# EAGLE design arduino_shield (EAGLE 8.3.1)
Integrated shield for surverying land based on altimeter, GPS, and file logging.
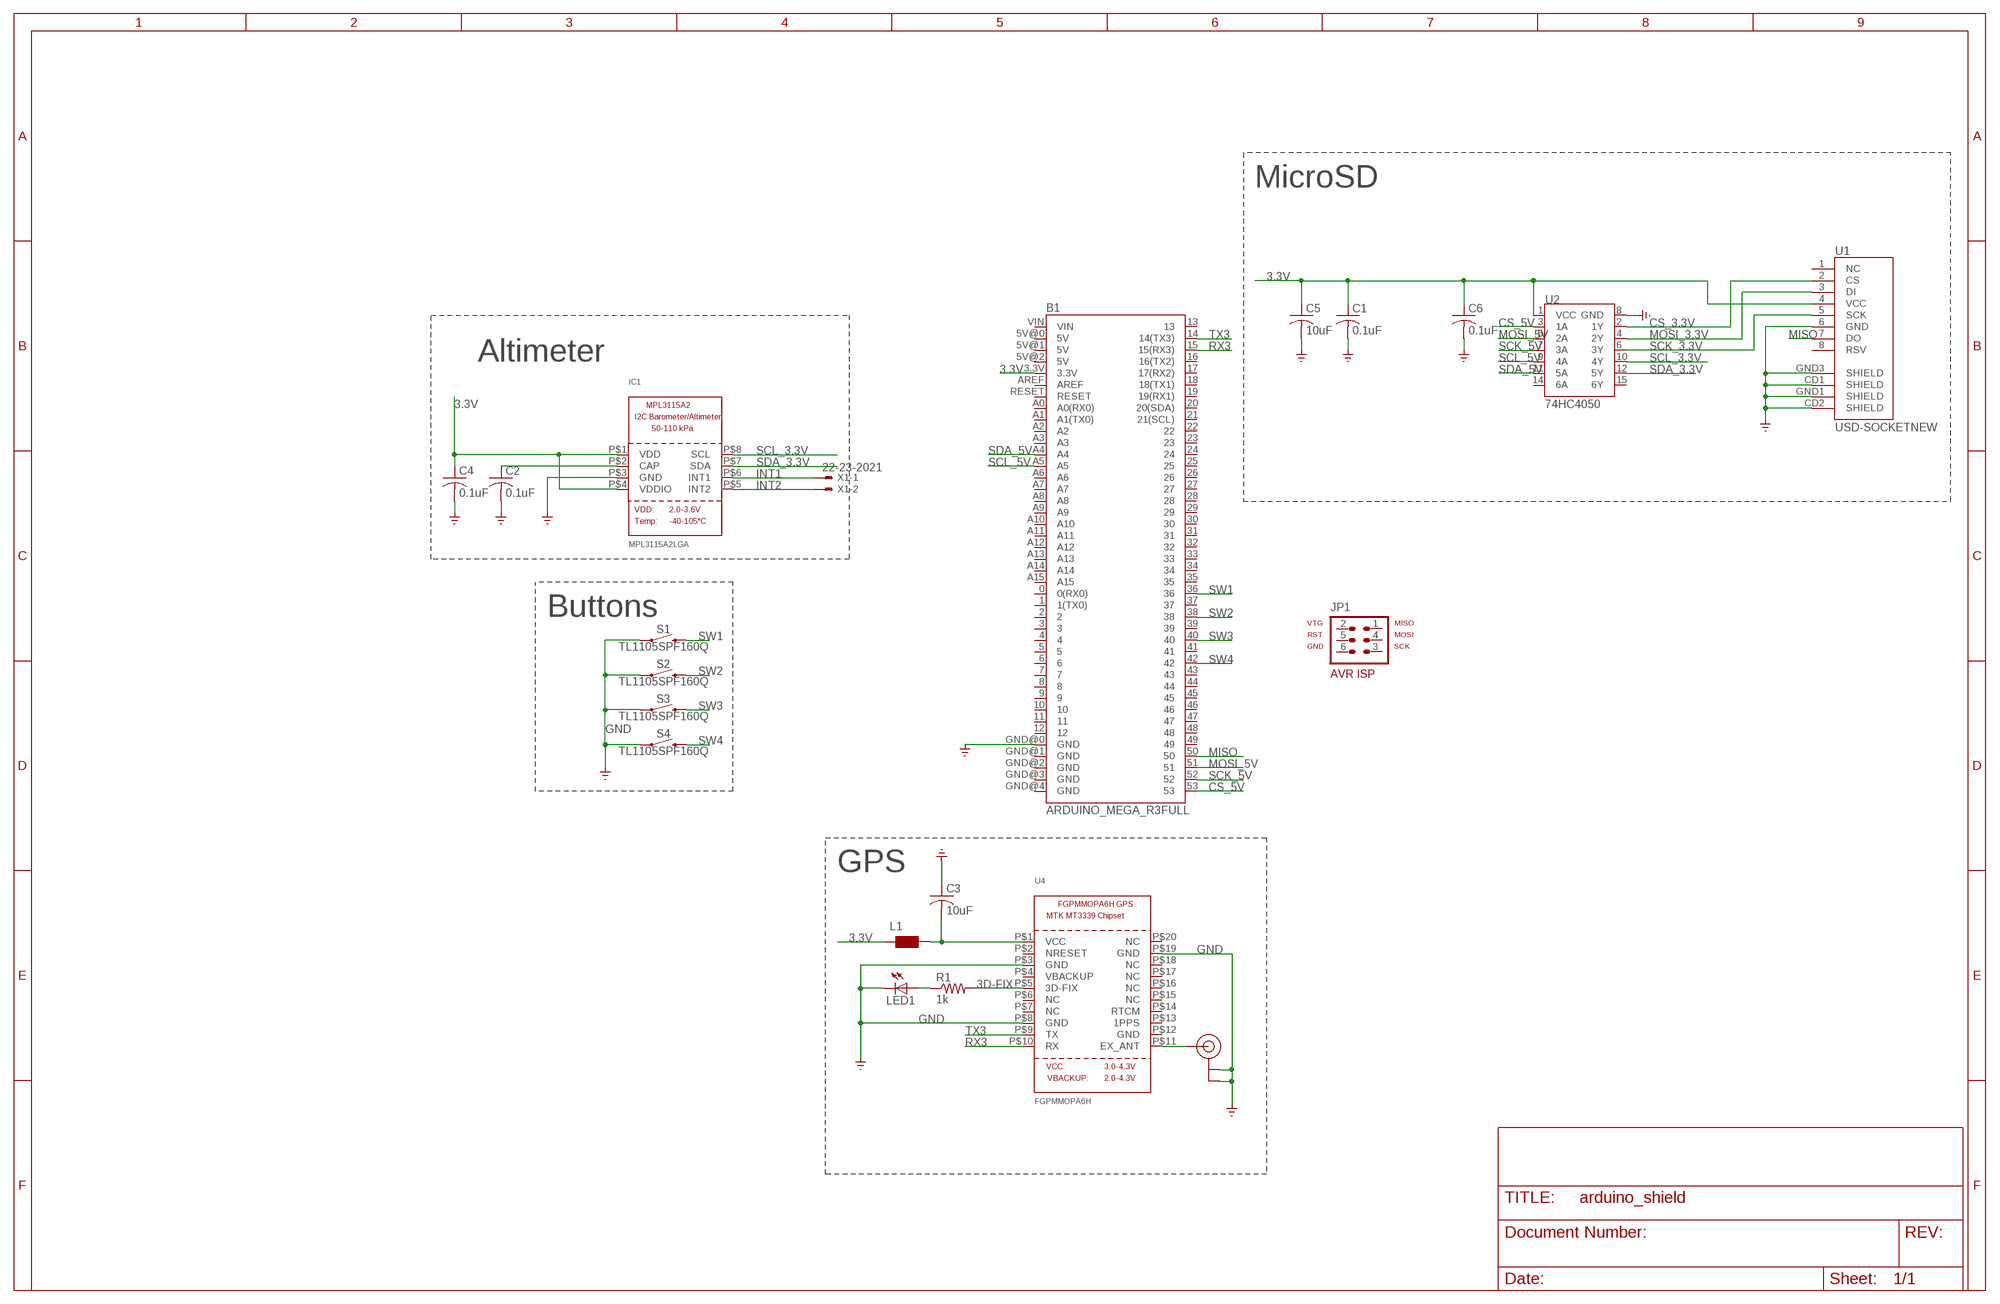
[diagram p0: schematic, sheet 1]

## Parts
B1  ARDUINO_MEGA_R3FULL  [ARDUINO_MEGA]
C1  0.1uF  C-USC1206  [C1206]
C2  0.1uF  C-USC1206  [C1206]
C3  10uF  C-USC1206  [C1206]
C4  0.1uF  C-USC1206  [C1206]
C5  10uF  C-USC1206  [C1206]
C6  0.1uF  C-USC1206  [C1206]
IC1  MPL3115A2LGA  [LGA8]
JP1  AVR-ISP-6  [AVR-ISP-6]
L1  WE-CBF_1206  [1206]
LED1  LEDSMT1206  [1206]
R1  1k  R-US_R1206  [R1206]
S1  TL1105SPF160Q  MOMENTARY-SWITCH-SPST-PTH-6.0MM  [TACTILE_SWITCH_PTH_6.0MM]
S2  TL1105SPF160Q  MOMENTARY-SWITCH-SPST-PTH-6.0MM  [TACTILE_SWITCH_PTH_6.0MM]
S3  TL1105SPF160Q  MOMENTARY-SWITCH-SPST-PTH-6.0MM  [TACTILE_SWITCH_PTH_6.0MM]
S4  TL1105SPF160Q  MOMENTARY-SWITCH-SPST-PTH-6.0MM  [TACTILE_SWITCH_PTH_6.0MM]
U1  USD-SOCKETNEW  [MICRO-SD-SOCKET-PP]
U2  74HC4050  HEX_CONVERTER  [SO16]
U4  FGPMMOPA6H  GPS_FGPMMOPA6H  [FGPMMOPA6H]
U$20  U.FL  [U.FL]
X1  22-23-2021  [22-23-2021]

## Nets
3.3V: B1.3.3V C1.1 C4.1 C5.1 C6.1 IC1.P$1(VDD) IC1.P$4(VDDIO) L1.1 U1.4(VCC) U2.1(VCC)
3D-FIX: R1.2 U4.P$5(3D-FIX)
3D-FIX_R: LED1.A R1.1
3V3_CLEAN: C3.2 L1.2 U4.P$1(VCC)
CAP: C2.1 IC1.P$2(CAP)
CS_3.3V: U1.2(CS) U2.2(1Y)
CS_5V: B1.53 U2.3(1A)
EX_ANT: U4.P$11(EX_ANT) U$20.P$3(SIGNAL)
GND: B1.GND@0(GND) C1.2 C2.2 C3.1 C4.2 C5.2 C6.2 IC1.P$3(GND) LED1.C S1.1 S2.1 S3.1 S4.1 U1.6(GND) U1.CD1(SHIELD) U1.CD2(SHIELD) U1.GND1(SHIELD) U1.GND3(SHIELD) U2.8(GND) U4.P$3(GND) U4.P$8(GND) U4.P$19(GND) U$20.P$1(GND) U$20.P$2(GND) ; supply symbol labelled GND_
INT1: IC1.P$6(INT1) X1.1
INT2: IC1.P$5(INT2) X1.2
MISO: B1.50 U1.7(DO)
MOSI_3.3V: U1.3(DI) U2.4(2Y)
MOSI_5V: B1.51 U2.5(2A)
RX3: B1.15(15(RX3)) U4.P$10(RX)
SCK_3.3V: U1.5(SCK) U2.6(3Y)
SCK_5V: B1.52 U2.7(3A)
SCL_3.3V: IC1.P$8(SCL) U2.10(4Y)
SCL_5V: B1.A5 U2.9(4A)
SDA_3.3V: IC1.P$7(SDA) U2.12(5Y)
SDA_5V: B1.A4 U2.11(5A)
SW1: B1.36 S1.3
SW2: B1.38 S2.3
SW3: B1.40 S3.3
SW4: B1.42 S4.3
TX3: B1.14(14(TX3)) U4.P$9(TX)
Unconnected: B1.0(0(RX0)) B1.1(1(TX0)) B1.2 B1.3 B1.4 B1.5 B1.5V@0(5V) B1.5V@1(5V) B1.5V@2(5V) B1.6 B1.7 B1.8 B1.9 B1.10 B1.11 B1.12 B1.13 B1.16(16(TX2)) B1.17(17(RX2)) B1.18(18(TX1)) B1.19(19(RX1)) B1.20(20(SDA)) B1.21(21(SCL)) B1.22 B1.23 B1.24 B1.25 B1.26 B1.27 B1.28 B1.29 B1.30 B1.31 B1.32 B1.33 B1.34 B1.35 B1.37 B1.39 B1.41 B1.43 B1.44 B1.45 B1.46 B1.47 B1.48 B1.49 B1.A0(A0(RX0)) B1.A1(A1(TX0)) B1.A2 B1.A3 B1.A6 B1.A7 B1.A8 B1.A9 B1.A10 B1.A11 B1.A12 B1.A13 B1.A14 B1.A15 B1.AREF B1.GND@1(GND) B1.GND@2(GND) B1.GND@3(GND) B1.GND@4(GND) B1.RESET B1.VIN JP1.1 JP1.2 JP1.3 JP1.4 JP1.5 JP1.6 U1.1(NC) U1.8(RSV) U2.14(6A) U2.15(6Y) U4.P$2(NRESET) U4.P$4(VBACKUP) U4.P$6(NC) U4.P$7(NC) U4.P$12(GND) U4.P$13(1PPS) U4.P$14(RTCM) U4.P$15(NC) U4.P$16(NC) U4.P$17(NC) U4.P$18(NC) U4.P$20(NC)

## Notes on the sheet
- MicroSD
- Altimeter
- Buttons
- GPS

## Library data of the parts
B1 = SparkFun-Boards:ARDUINO_MEGA_R3: Arduino Mega R3 ATmega2560 R3 compatible footprint. SparkFun Products: Arduino Mega 2560 R3 <https://www.sparkfun.com/products/11061>
C1-C6 = adafruit:C-US: CAPACITOR, American symbol
IC1 = microbuilder:MPL3115A2
JP1 = atmel-1:AVR-ISP-6: AVR ISP-6 Serial Programming Header
L1 = wuerth-elektronik:WE-CBF: SMD EMI Suppression Ferrite Beads - excellent anti-EMI properties - low DCR - impedances till 3000 ohms - rated current up to 6 A
LED1 = adafruit:LED: LED OSRAM: - CHIPLED LG R971, LG N971, LY N971, LG Q971, LY Q971, LO R971, LY R971 LH N974, LH R974 LS Q976, LO Q976, LY Q976 LO Q996 - Hyper CHIPLED LW Q18S LB Q993, LB Q99A, LB R99A - SideLED LS A670, LO A670, LY A670, LG A670, LP A670 LB A673, LV A673, LT A673, LW A673 LH A674 LY A675 LS A676, LA A676, LO A676, LY A676, LW A676 LS A679, LY A679, LG A679 - Hyper Micro SIDELED® LS Y876, LA Y876, LO Y876, LY Y876 LT Y87S - SmartLED LW L88C, LW L88S LB L89C, LB L89S, LG L890 LS L89K, LO L89K, LY L89K LS L896, LA L896, LO L896, LY L896 - TOPLED LS T670, LO T670, LY T670, LG T670, LP T670 LSG T670, LSP T670, LSY T670, LOP T670, LYG T670 LG T671, LOG T671, LSG T671 LB T673, LV T673, LT T673, LW T673 LH T674 LS T676, LA T676, LO T676, LY T676, LB T676, LH T676, LSB T676, LW T676 LB T67C, LV T67C, LT T67C, LS T67K, LO T67K, LY T67K, LW E67C LS E67B, LA E67B, LO E67B, LY E67B, LB E67C, LV E67C, LT E67C LW T67C LS T679, LY T679, LG T679 LS T770, LO T770, LY T770, LG T770, LP T770 LB T773, LV T773, LT T773, LW T773 LH T774 LS E675, LA E675, LY E675, LS T675 LS T776, LA T776, LO T776, LY T776, LB T776 LHGB T686 LT T68C, LB T68C - Hyper Mini TOPLED® LB M676 - Mini TOPLED Santana® LG M470 LS M47K, LO M47K, LY M47K Source: http://www.osram.convergy.de/
R1 = adafruit:R-US_: RESISTOR, American symbol
S1-S4 = SparkFun-Switches:MOMENTARY-SWITCH-SPST: Momentary Switch (Pushbutton) - SPST Normally-open (NO) SPST momentary switches (buttons, pushbuttons). Variants PTH-12MM - 12mm square, through-hole Momentary Pushbutton Switch - 12mm Square <https://www.sparkfun.com/products/9190> (COM-09190) PTH-6.0MM, PTH-6.0MM-KIT - 6.0mm square, through-hole Mini Pushbutton Switch <https://www.sparkfun.com/products/97> (COM-00097) KIT package intended for soldering kit's - only one side of pads' copper is exposed. PTH-RIGHT-ANGLE-KIT - Right-angle, through-hole Right Angle Tactile Button <https://www.sparkfun.com/products/10791> - Used on SparkFun BigTime Watch Kit <https://www.sparkfun.com/products/11734> SMD-12MM - 12mm square, surface-mount Tactile Button - SMD (12mm) <https://www.sparkfun.com/products/12993> (COM-12993) Used on SparkFun PicoBoard <https://www.sparkfun.com/products/11888> SMD-4.5MM - 4.5mm Square Trackball Switch Used on SparkFun Blackberry Trackballer Breakout <https://www.sparkfun.com/products/13169> SMD-4.6MMX2.8MM - 4.60mm x 2.80mm, surface mount Used on SparkFun SAMD21 Mini Breakout <https://www.sparkfun.com/products/13664> SMD-5.2MM, SMD-5.2-REDUNDANT - 5.2mm square, surface-mount Mini Pushbutton Switch - SMD <https://www.sparkfun.com/products/8720> (COM-08720) Used on Arduino Pro Mini <https://www.sparkfun.com/products/11114> REDUNDANT package connects both switch circuits together SMD-6.0X3.5MM - 6.0 x 3.5mm, surface mount Momentary Reset Switch SMD <https://www.sparkfun.com/products/8229> (COM-08229) SMD-6.2MM-TALL - 6.2mm square, surface mount Tactile Button - SMD (6mm) <https://www.sparkfun.com/products/12992> Used on SparkFun Digital Sandbox <https://www.sparkfun.com/products/12651> SMD-RIGHT-ANGLE - Right-angle, surface mount Used on SparkFun Block for Intel® Edison - Arduino <https://www.sparkfun.com/products/13036>; PROD_ID: SWCH-08441; SF_SKU: COM-00097
U1 = SparkFun:USD-SOCKET: microSD Socket Push-push type uSD socket. Schematic element and footprint production proven. Spark Fun Electronics SKU : PRT-00127. tDoc lines correctly indicate media card edge positions when inserting (unlocked, locked, depressed).
U2 = SparkFun-IC-Comms:HEX_CONVERTER: 74HC4050 Hex Buffer 74HC4050 Hex Buffer Level Shifter SMD SO016 SparkFun Products CAN-BUS Shield <https://www.sparkfun.com/products/13262> (DEV-13262) SparkFun MP3 Player Shield <https://www.sparkfun.com/products/12660> (DEV-12660) SparkFun microSD Shield <https://www.sparkfun.com/products/12761> (DEV-12761) SparkFun USB Host Shield <https://www.sparkfun.com/products/9947> (DEV-09947); PROD_ID: IC-09604
U4 = microbuilder:GPS_FGPMMOPA6H: GPS Module - MTK MT3339 Chipset, -165dBm sensitivity, 22 channels, 10Hz, auto-select external antenna options
U$20 = microbuilder:U.FL: U.FL Antenna Connector
X1 = con-molex:22-23-2021: .100" (2.54mm) Center Header - 2 Pin; MF: MOLEX; MPN: 22-23-2021; OC_FARNELL: 1462926; OC_NEWARK: 25C3832

## Board
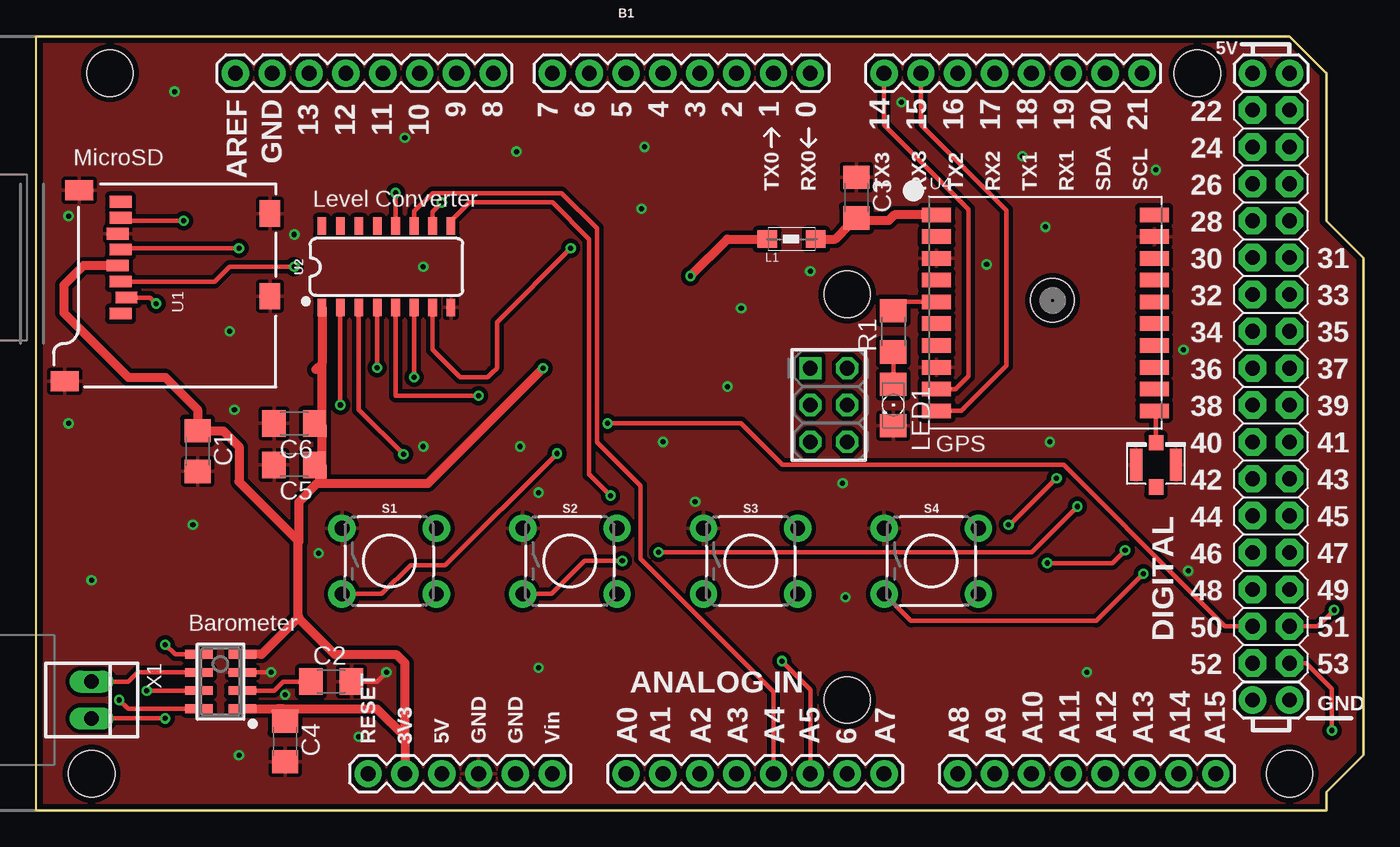
[diagram p1: board, top side]
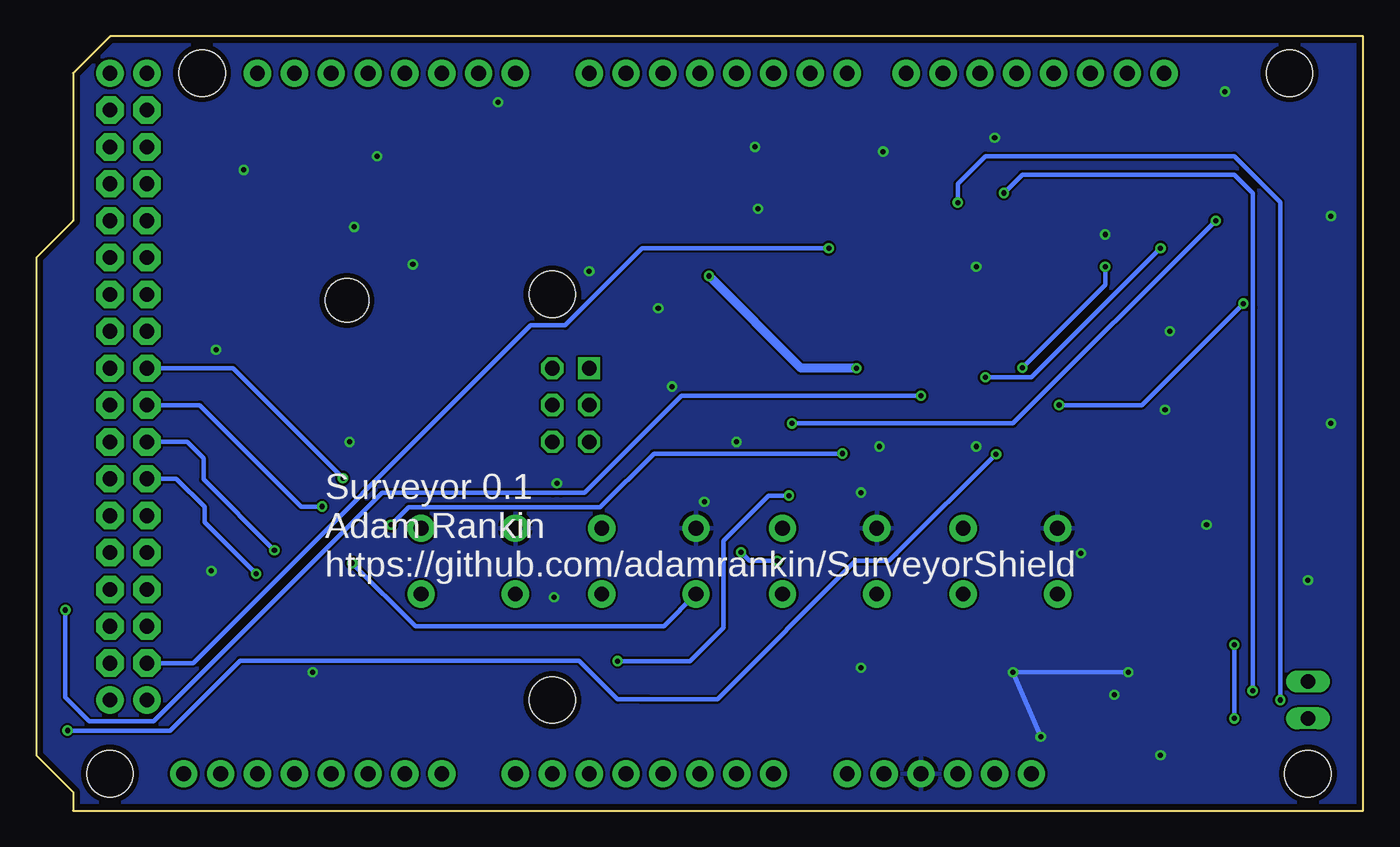
[diagram p2: board, bottom side, seen from below]

Size 91.44 x 53.34 mm. Coordinates in mm from the lower left corner, seen from the top.
Outline: 86.36,53.34 88.9,50.8 88.9,40.64 91.44,38.1 91.44,3.81 88.9,1.27 88.9,0 0,0 0,53.34 86.36,53.34
Copper layers (1*16): Top 0.0356mm / dielectric 1.5011mm / Bottom 0.0356mm
Design rules "oshpark-2layer": minimum track width 6mil, minimum drill 13mil, track to track 6mil, track to pad 6mil, pad to pad 6mil, via to via 6mil, smd to smd 6mil, copper to edge 15mil, drill to drill 6mil, minimum pad ring 7mil, minimum via ring 7mil, stop-mask expansion 2.5mil, vias tented up to drill 0mil, thermal gap 10mil

### Footprints (pad centres in the part's own frame; a part is rotated, then mirrored left to right if it is on the bottom)
ARDUINO_MEGA = drill 1.016 pad 1.88: 0 13.97,24.13; 1 11.43,24.13; 2 8.89,24.13; 3 6.35,24.13; 3.3V -13.97,-24.13; 4 3.81,24.13; 5 1.27,24.13; 5V@0 -11.43,-24.13; 5V@1 44.45,24.13; 5V@2 46.99,24.13; 6 -1.27,24.13; 7 -3.81,24.13; 8 -7.874,24.13; 9 -10.414,24.13; 10 -12.954,24.13; 11 -15.494,24.13; 12 -18.034,24.13; 13 -20.574,24.13; 14 19.05,24.13; 15 21.59,24.13; 16 24.13,24.13; 17 26.67,24.13; 18 29.21,24.13; 19 31.75,24.13; 20 34.29,24.13; 21 36.83,24.13; A0 1.27,-24.13; A1 3.81,-24.13; A2 6.35,-24.13; A3 8.89,-24.13; A4 11.43,-24.13; A5 13.97,-24.13; A6 16.51,-24.13; A7 19.05,-24.13; A8 24.13,-24.13; A9 26.67,-24.13; A10 29.21,-24.13; A11 31.75,-24.13; A12 34.29,-24.13; A13 36.83,-24.13; A14 39.37,-24.13; A15 41.91,-24.13; AREF -25.654,24.13; GND@0 -8.89,-24.13; GND@1 -6.35,-24.13; GND@2 44.45,-19.05; GND@3 46.99,-19.05; GND@4 -23.114,24.13; RESET -16.51,-24.13; VIN -3.81,-24.13 | drill 1.016 pad 1.88 octagon: 22 44.45,21.59; 23 46.99,21.59; 24 44.45,19.05; 25 46.99,19.05; 26 44.45,16.51; 27 46.99,16.51; 28 44.45,13.97; 29 46.99,13.97; 30 44.45,11.43; 31 46.99,11.43; 32 44.45,8.89; 33 46.99,8.89; 34 44.45,6.35; 35 46.99,6.35; 36 44.45,3.81; 37 46.99,3.81; 38 44.45,1.27; 39 46.99,1.27; 40 44.45,-1.27; 41 46.99,-1.27; 42 44.45,-3.81; 43 46.99,-3.81; 44 44.45,-6.35; 45 46.99,-6.35; 46 44.45,-8.89; 47 46.99,-8.89; 48 44.45,-11.43; 49 46.99,-11.43; 50 44.45,-13.97; 51 46.99,-13.97; 52 44.45,-16.51; 53 46.99,-16.51 | hole 3.2: -34.29,24.13; -35.56,-24.13; 16.51,8.89; 16.51,-19.05; 40.64,24.13; 46.99,-24.13
C1206 = smd 1.6 x 1.8: 1 -1.4,0; 2 1.4,0
LGA8 = smd 1.9 x 0.6: P$1 -1.5,1.875; P$2 -1.5,0.625; P$3 -1.5,-0.625; P$4 -1.5,-1.875; P$5 1.5,-1.875; P$6 1.5,-0.625; P$7 1.5,0.625; P$8 1.5,1.875
AVR-ISP-6 = drill 1.016 square: 1 -2.54,-1.27 | drill 1.016 octagon: 2 -2.54,1.27; 3 0,-1.27; 4 0,1.27; 5 2.54,-1.27; 6 2.54,1.27
1206 = smd 1.35 x 1.2: 1 -1.7,0; 2 1.65,0
1206' = smd 1.6 x 1.803: A -1.422,0; C 1.422,0
R1206 = smd 1.6 x 1.803: 1 -1.422,0; 2 1.422,0
TACTILE_SWITCH_PTH_6.0MM = drill 1.016 pad 1.88: 1 -3.251,2.261; 2 3.251,2.261; 3 -3.251,-2.261; 4 3.251,-2.261
MICRO-SD-SOCKET-PP = smd 0.8 x 1.5: 1 -8.94,10.7; 2 -7.84,10.3; 3 -6.74,10.7; 4 -5.64,10.9; 5 -4.54,10.7; 6 -3.44,10.9; 7 -2.34,10.7; 8 -1.24,10.7 | smd 1.8 x 1.4: CD1 -2.05,0.4; CD2 -7.75,0.4 | smd 1.4 x 1.9: GND1 -13.6,14.55; GND3 -0.45,13.55
SO16 = smd 0.6 x 1.2: 1 -4.445,-2.8; 2 -3.175,-2.8; 3 -1.905,-2.8; 4 -0.635,-2.8; 5 0.635,-2.8; 6 1.905,-2.8; 7 3.175,-2.8; 8 4.445,-2.8; 9 4.445,2.8; 10 3.175,2.8; 11 1.905,2.8; 12 0.635,2.8; 13 -0.635,2.8; 14 -1.905,2.8; 15 -3.175,2.8; 16 -4.445,2.8
FGPMMOPA6H = smd 2 x 1: P$1 -7.5,6.75; P$2 -7.5,5.25; P$3 -7.5,3.75; P$4 -7.5,2.25; P$5 -7.5,0.75; P$6 -7.5,-0.75; P$7 -7.5,-2.25; P$8 -7.5,-3.75; P$9 -7.5,-5.25; P$10 -7.5,-6.75; P$11 7.5,-6.75; P$12 7.5,-5.25; P$13 7.5,-3.75; P$14 7.5,-2.25; P$15 7.5,-0.75; P$16 7.5,0.75; P$17 7.5,2.25; P$18 7.5,3.75; P$19 7.5,5.25; P$20 7.5,6.75 | hole 3: 0.5,0.85
U.FL = smd 2.2 x 0.85: P$1 0,1.375; P$2 0,-1.375 | smd 1.05 x 1: P$3 1.525,0; P$4 -1.525,0
22-23-2021 = drill 1 long: 1 -1.27,0; 2 1.27,0

### Placement (x,y rotation side)
B1  39.37,26.67 0 top
C1  11.11,24.77 270 top
C2  20.32,8.89 0 top
C3  56.52,42.23 270 top
C4  17.14,4.76 270 top
C5  17.78,23.81 180 top
C6  17.78,26.67 180 top
IC1  12.7,8.89 180 top
JP1  54.61,27.94 270 top
L1  52.07,39.37 0 top
LED1  [1206']  59.05,27.94 270 top
R1  59.05,33.02 90 top
S1  24.32,17.19 0 top
S2  36.77,17.19 0 top
S3  49.22,17.19 0 top
S4  61.68,17.19 0 top
U1  16.51,43.18 90 top
U2  24.13,37.47 0 top
U4  69.53,34.29 0 top
U$20  77.15,23.81 90 top
X1  3.81,7.62 270 top

### Tracks (layer width: path | path; a pad name or v marks a point on that pad's centre or on a via)
3.3V  (via drill 0.35)
  Top 0.305: 19.64,25.72 19.68,25.67 | 19.68,27.94 19.68,27.93 | C6.1 19.59,26.67 19.68,26.58
  Top 0.61: 19.68,30.8 19.27,30.38 | U1.4 3.25,37.54 1.91,36.2 1.91,34.29 6.35,29.84 8.89,29.84 11.11,27.62 C1.1 12.89,26.16 13.97,25.08 13.97,22.66 18.1,18.53 | 19.68,30.8 19.68,27.93 19.68,26.58 19.68,25.67 19.68,23.83 | 19.68,23.83 19.68,22.86 19.37,22.54 | 19.37,22.54 18.1,21.27 18.1,18.53 | 19.37,22.54 26.99,22.54 v34.93,30.48 | v45.09,36.83 47.62,39.37 L1.1 | U2.1 19.68,30.8 | 17.05,7.01 16.6,7.01 | 17.05,7.01 23.46,7.01 25.4,5.08 | 16.51,6.92 16.6,7.01 | C5.1 19.66,23.81 19.68,23.83 | 18.05,13.29 15.53,10.77 IC1.P$4 | 18.05,13.29 18.1,13.34 | 18.05,13.29 20.57,10.77 24.79,10.77 25.4,10.16 25.4,5.08 | 18.05,13.29 18.05,18.48 18.1,18.53 | 25.4,5.08 B1.3.3V | IC1.P$1 16.6,7.01 | 17.05,7.01 17.14,6.92 C4.1
  Bottom 0.61: v34.93,30.48 38.73,30.48 v45.09,36.83
3D-FIX
  Top 0.305: U4.P$5 59.65,35.04 R1.2
3D-FIX_R
  Top 0.305: R1.1 LED1.A
3V3_CLEAN
  Top 0.61: L1.2 55.06,39.37 56.03,40.34 | 56.03,40.34 C3.2 | U4.P$1 59.14,41.04 58.74,40.64 56.33,40.64 56.03,40.34
CAP
  Top 0.305: IC1.P$2 16.39,8.27 17.02,8.89 C2.1
CS_3.3V  (via drill 0.35)
  Top 0.305: U1.2 7.84,35.34 v8.25,34.92 | U2.2 v20.95,27.94
  Bottom 0.305: v20.95,27.94 15.24,27.94 v8.25,34.92
CS_5V  (via drill 0.35)
  Top 0.305: U2.3 22.22,27.62 v25.3,24.55 | B1.53 87.52,10.16 89.29,8.39 v89.29,5.52
  Bottom 0.3: 49.78,7.67 44.51,7.67 34.98,17.2 32.67,17.2 32.02,17.85
  Bottom 0.305: v25.3,24.55 25.32,24.55 32.02,17.85 32.23,17.63 | 49.17,7.67 49.78,7.67 51.37,7.67 54.04,10.34 77.4,10.34 82.22,5.52 v89.29,5.52
EX_ANT
  Top 0.305: U$20.P$3 77.15,27.42 U4.P$11
GND  (via drill 0.35)
  Top 0.305: IC1.P$3 16.18,9.52 v16.19,9.53 | C2.2 23.49,8.89 v24.13,9.53
  Bottom 0.305: v22.22,5.08 v24.13,9.53 v16.19,9.53
  other vias: 10.79,19.68 13.97,3.81 34.61,21.91 47.62,29.21 55.76,14.71 69.85,25.4 69.55,40.21 3.81,15.88 19.45,17.73 13.33,33.02 9.52,49.53 41.91,45.72 67.94,45.09 13.65,27.62 26.67,37.47 53.34,37.15 48.58,34.61 55.56,22.54 77.15,44.13 79.38,16.51 2.22,26.67 2.22,40.96 17.78,39.69 45.4,21.27 43.18,25.4 33.34,25.08 26.67,25.08 79.06,31.75 72.39,9.53 34.61,9.84 25.4,46.35 17.14,7.99 33.08,45.4 65.49,37.62 41.7,41.46 59.62,48.79
  pour Top (isolate 0.305): 0,53.34 86.36,53.34 88.9,50.8 88.9,40.64 91.44,38.1 91.44,3.81 88.9,1.27 88.9,0 0,0
  pour Bottom: -2.54,55.24 92.71,55.24 94.61,53.34 94.61,-3.17 92.71,-5.08 -0.63,-5.08 -3.17,-2.54 -3.17,54.61
INT1
  Top 0.305: X1.1 6.35,8.89 6.98,9.52 IC1.P$6
INT2  (via drill 0.35)
  Top 0.305: X1.2 v8.89,6.35 | IC1.P$5 9.55,10.77 v8.89,11.43
  Bottom 0.305: v8.89,11.43 v8.89,6.35
MISO  (via drill 0.35)
  Top 0.305: v10.16,40.64 6.01,40.64 U1.7 | v39.37,26.67 48.58,26.67 51.44,23.81 70.8,23.81 79.4,15.22 | 79.4,15.22 79.69,14.92 | 79.4,15.22 81.91,12.7 B1.50
  Bottom 0.305: v39.37,26.67 24.13,26.67 v10.16,40.64
MOSI_3.3V  (via drill 0.35)
  Top 0.305: U1.3 12.31,36.44 13.33,37.47 v17.78,37.47 | U2.4 v23.49,30.5
  Bottom 0.305: v17.78,37.47 17.78,36.22 v23.49,30.5
MOSI_5V  (via drill 0.35)
  Top 0.305: v30.48,28.57 24.76,28.57 U2.5 | B1.51 88.31,12.7 v89.43,13.82
  Bottom 0.305: v30.48,28.57 46.99,28.57 53.66,21.91 55.27,21.91 55.29,21.89 55.84,21.89 55.86,21.91 67.62,21.91 83.35,6.17 87.79,6.17 89.43,7.81 v89.43,13.82
RX3
  Top 0.305: B1.15 60.96,47.24 66.2,42.01 | 66.2,42.01 66.72,41.48 | U4.P$10 63.74,27.54 66.84,30.64 66.84,41.36 66.2,42.01
SCK_3.3V  (via drill 0.35)
  Top 0.305: v13.97,38.73 5.91,38.73 U1.5 | U2.6 v26.04,29.84
  Bottom 0.305: v26.04,29.84 22.86,29.84 v13.97,38.73
SCK_5V  (via drill 0.35)
  Top 0.305: 31.39,30.12 31.11,29.84 | 31.39,30.12 31.75,30.48 31.75,33.66 v36.83,38.73 | 31.11,29.84 29.21,29.84 27.3,31.75 U2.7 | 31.11,29.84 31.39,30.12
  Bottom 0.305: v36.83,38.73 49.69,38.73 55,33.43 57.38,33.43 80.64,10.16 B1.52
SCL_3.3V  (via drill 0.35)
  Top 0.305: IC1.P$8 6.32,7.01 v5.72,7.62 | U2.10 27.3,41.25 v27.94,41.89
  Bottom 0.305: v5.72,7.62 5.72,41.91 8.89,45.09 26.04,45.09 27.94,43.18 v27.94,41.89
SCL_5V  (via drill 0.35)
  Top 0.3: 38.09,23.15 38.13,23.15 v39.58,21.7 | 53.34,7.2 53.34,8.34 v51.38,10.3
  Top 0.305: U2.9 28.57,40.64 29.85,41.91 35.56,41.91 38.09,39.38 38.09,23.15 | B1.A5 53.34,7.2 53.34,7.91
  Bottom 0.3: v39.58,21.7 40.98,21.7 44.08,18.6 44.08,12.6 46.38,10.3 v51.38,10.3
SDA_3.3V  (via drill 0.35)
  Top 0.305: IC1.P$7 v7.63,8.27 v7.62,8.26 | U2.12 v24.76,42.55
  Bottom 0.305: v7.62,8.26 7.62,34.63 7.6,34.65 7.6,42.52 8.89,43.81 23.49,43.81 v24.76,42.55
SDA_5V
  Top 0.3: 41.64,22.39 41.64,17.36 45.56,13.43
  Top 0.305: U2.11 26.04,41.27 27.3,42.55 36.2,42.55 38.64,40.1 38.64,25.39 41.64,22.39 | 45.56,13.43 50.8,8.19 B1.A4
SW1  (via drill 0.35)
  Top 0.3: S1.3 23.8,14.93 25.78,16.9 28.18,16.9 v35.88,24.6
  Top 0.305: v67,19.7 67.11,19.7 v70.31,22.9
  Bottom 0.3: v35.88,24.6 48.88,24.6 52.58,20.9 65.8,20.9 v67,19.7
  Bottom 0.305: v70.31,22.9 77.89,30.48 B1.36
SW2  (via drill 0.35)
  Top 0.3: S2.3 35.51,14.93 37.78,17.2 v40.38,17.2 | 69.66,18.86 68.6,17.8 v42.88,17.8
  Top 0.305: 69.3,18.5 69.66,18.86 v71.75,20.95
  Bottom 0.3: v40.38,17.2 42.28,17.2 v42.88,17.8
  Bottom 0.305: v71.75,20.95 73.18,20.95 80.17,27.94 B1.38
SW3  (via drill 0.35)
  Top 0.305: v69.67,17.06 74.16,17.06 v75.03,17.93
  Bottom 0.3: 65.31,12.7 48.2,12.7 S3.3
  Bottom 0.305: v69.67,17.06 65.31,12.7 | v75.03,17.93 79.91,22.82 79.91,24.29 81.03,25.4 B1.40
SW4  (via drill 0.35)
  Top 0.3: 73.01,13.07 60.27,13.07 S4.3
  Top 0.305: 73.01,13.07 73.05,13.07 v76.3,16.32
  Bottom 0.305: v76.3,16.32 79.85,19.88 79.85,20.92 81.79,22.86 B1.42
TX3
  Top 0.305: B1.14 58.42,47.23 64.24,41.41 64.24,29.93 63.34,29.04 U4.P$9

### Text on the board
tPlace: MicroSD | Level Converter | GPS | Barometer
bPlace: Surveyor 0.1 / Adam Rankin / https://github.com/adamrankin/SurveyorShield